# EAGLE schematic projectVGA (EAGLE 4.16)
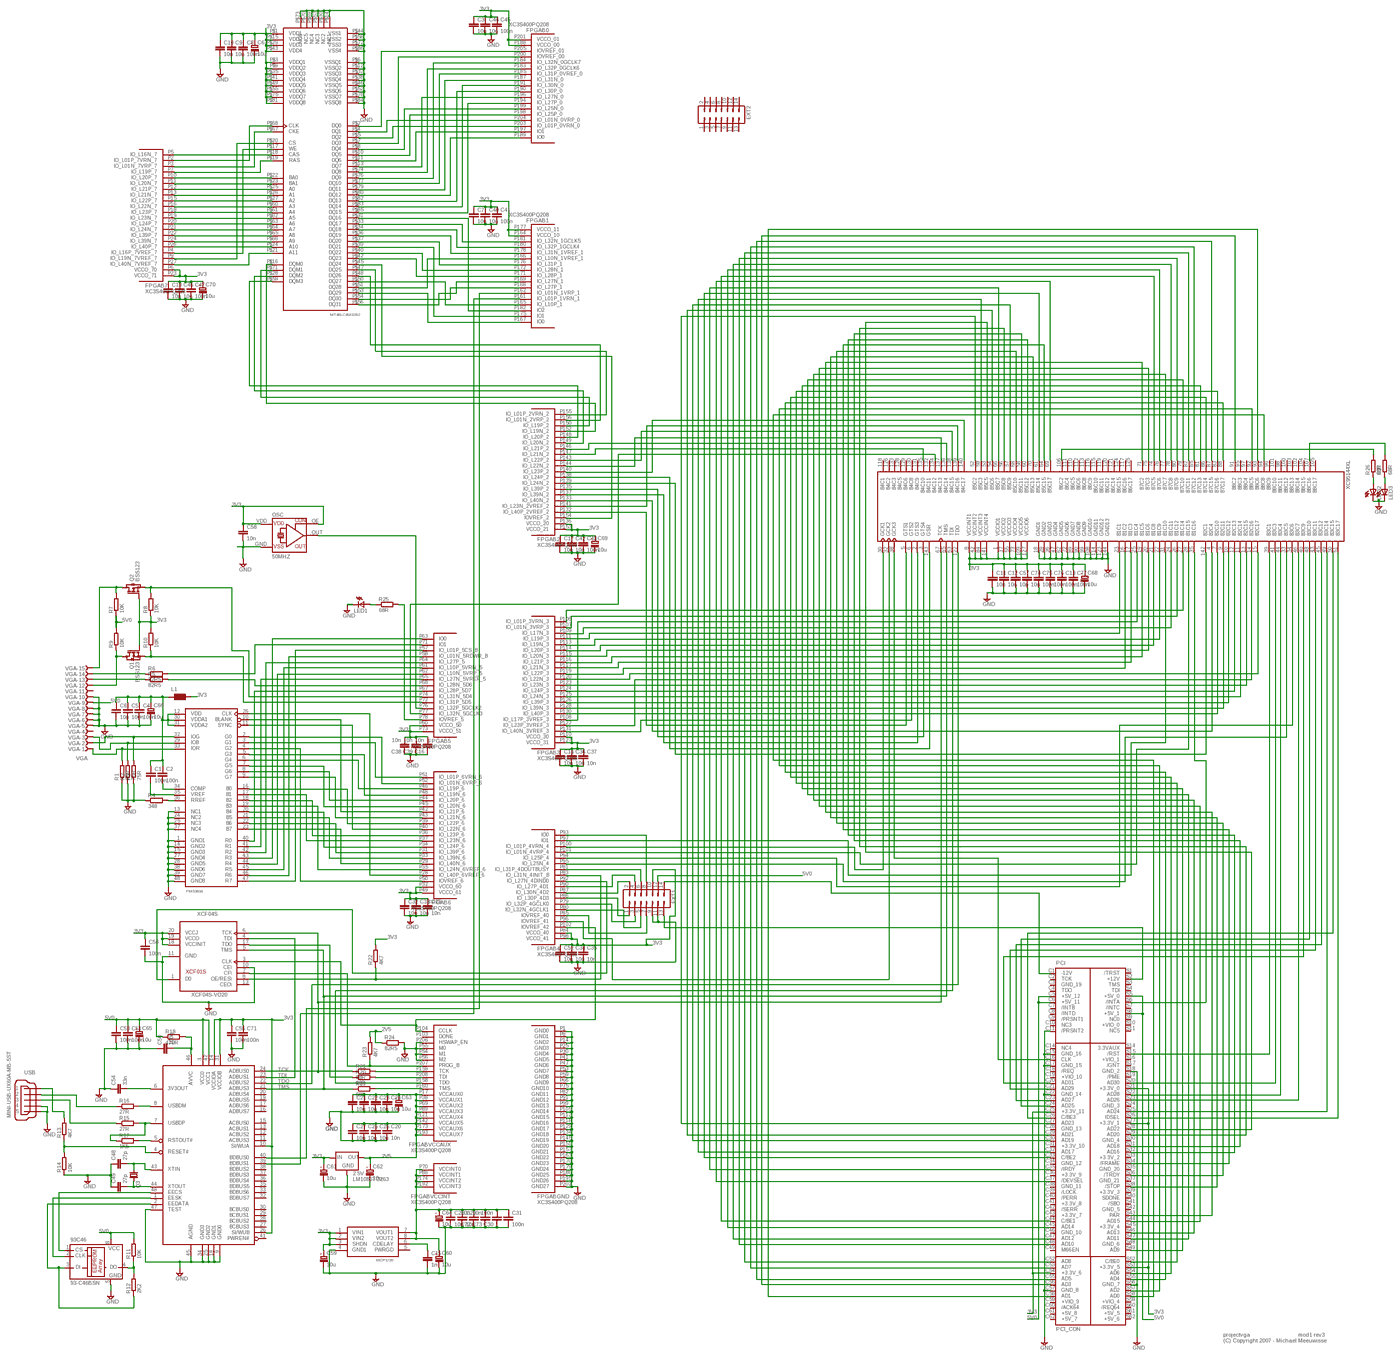
[diagram p0: schematic, sheet 1, overview]
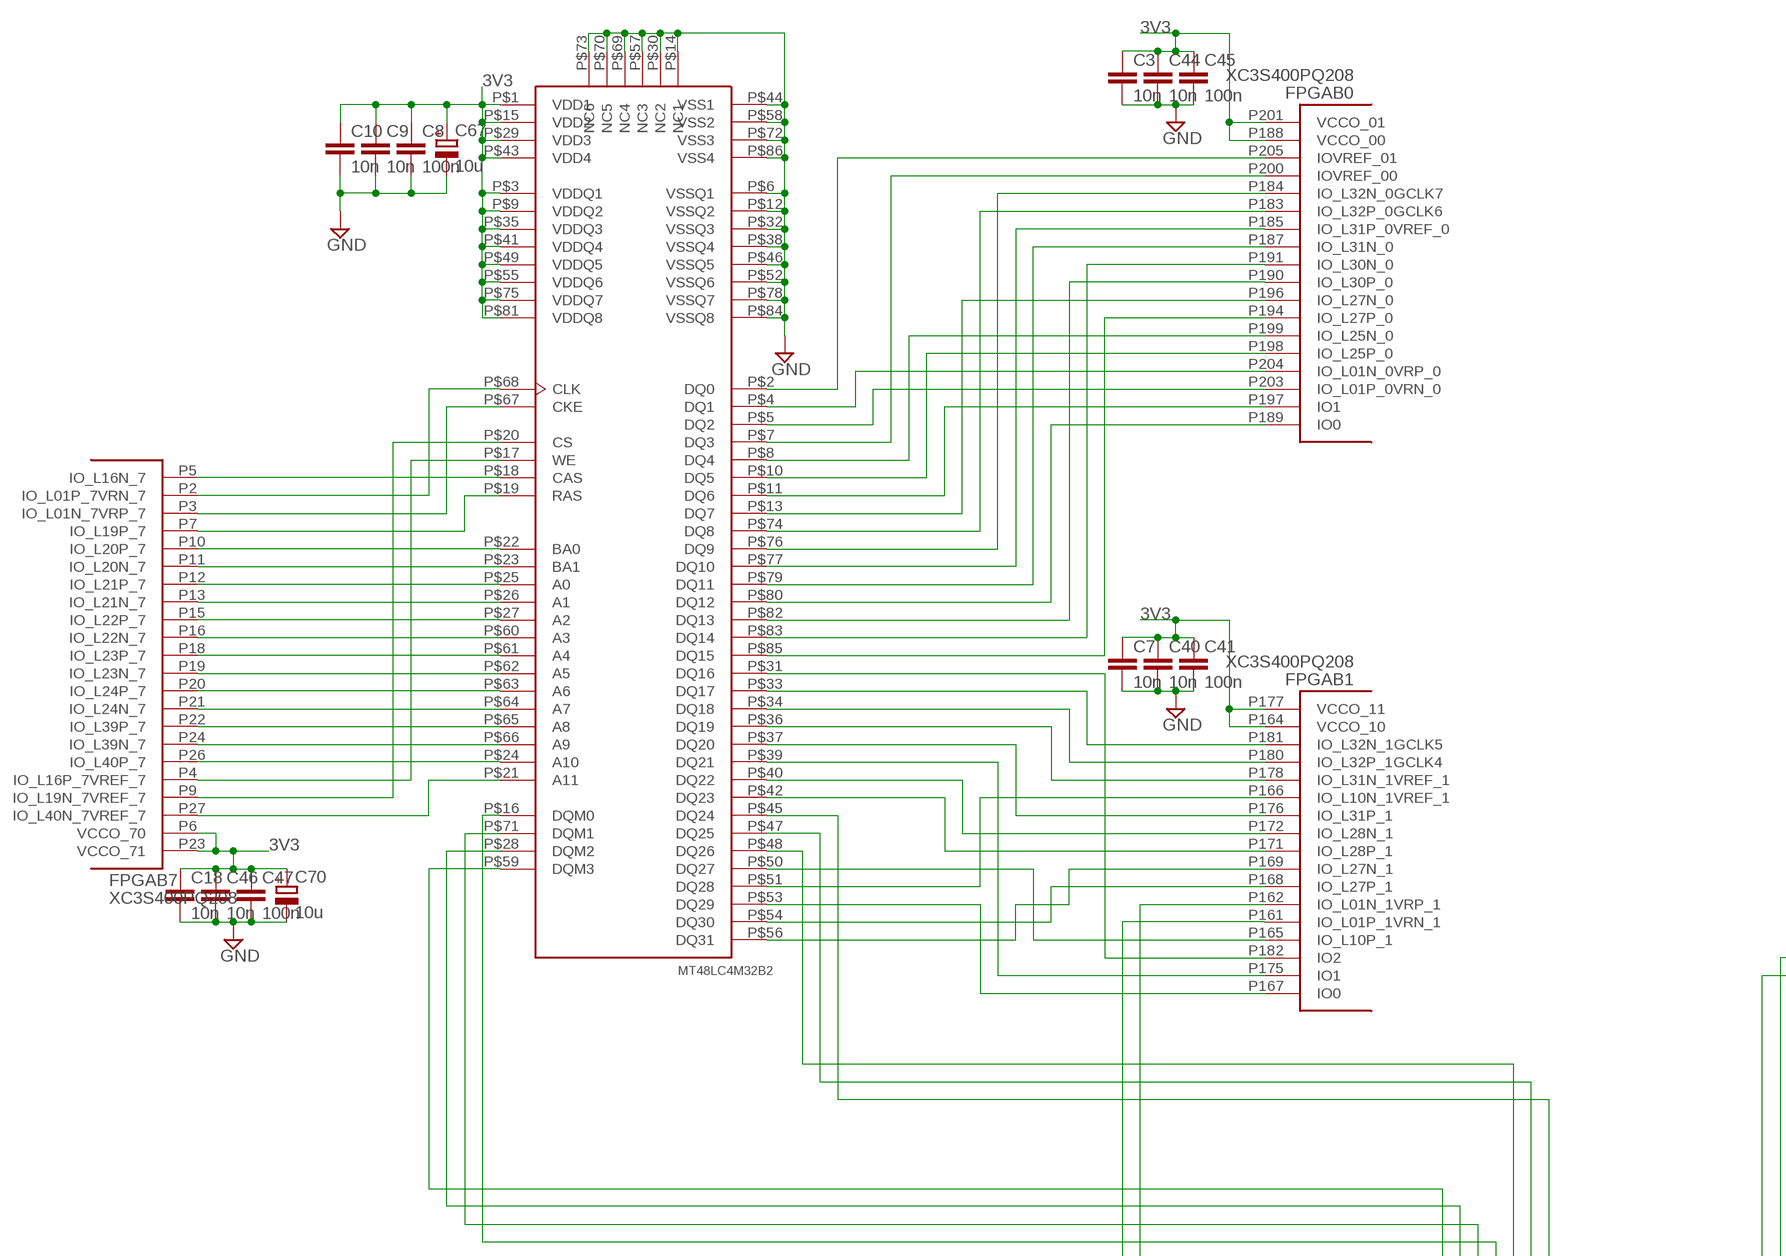
[diagram p1: schematic, sheet 1, part 1 of 4]
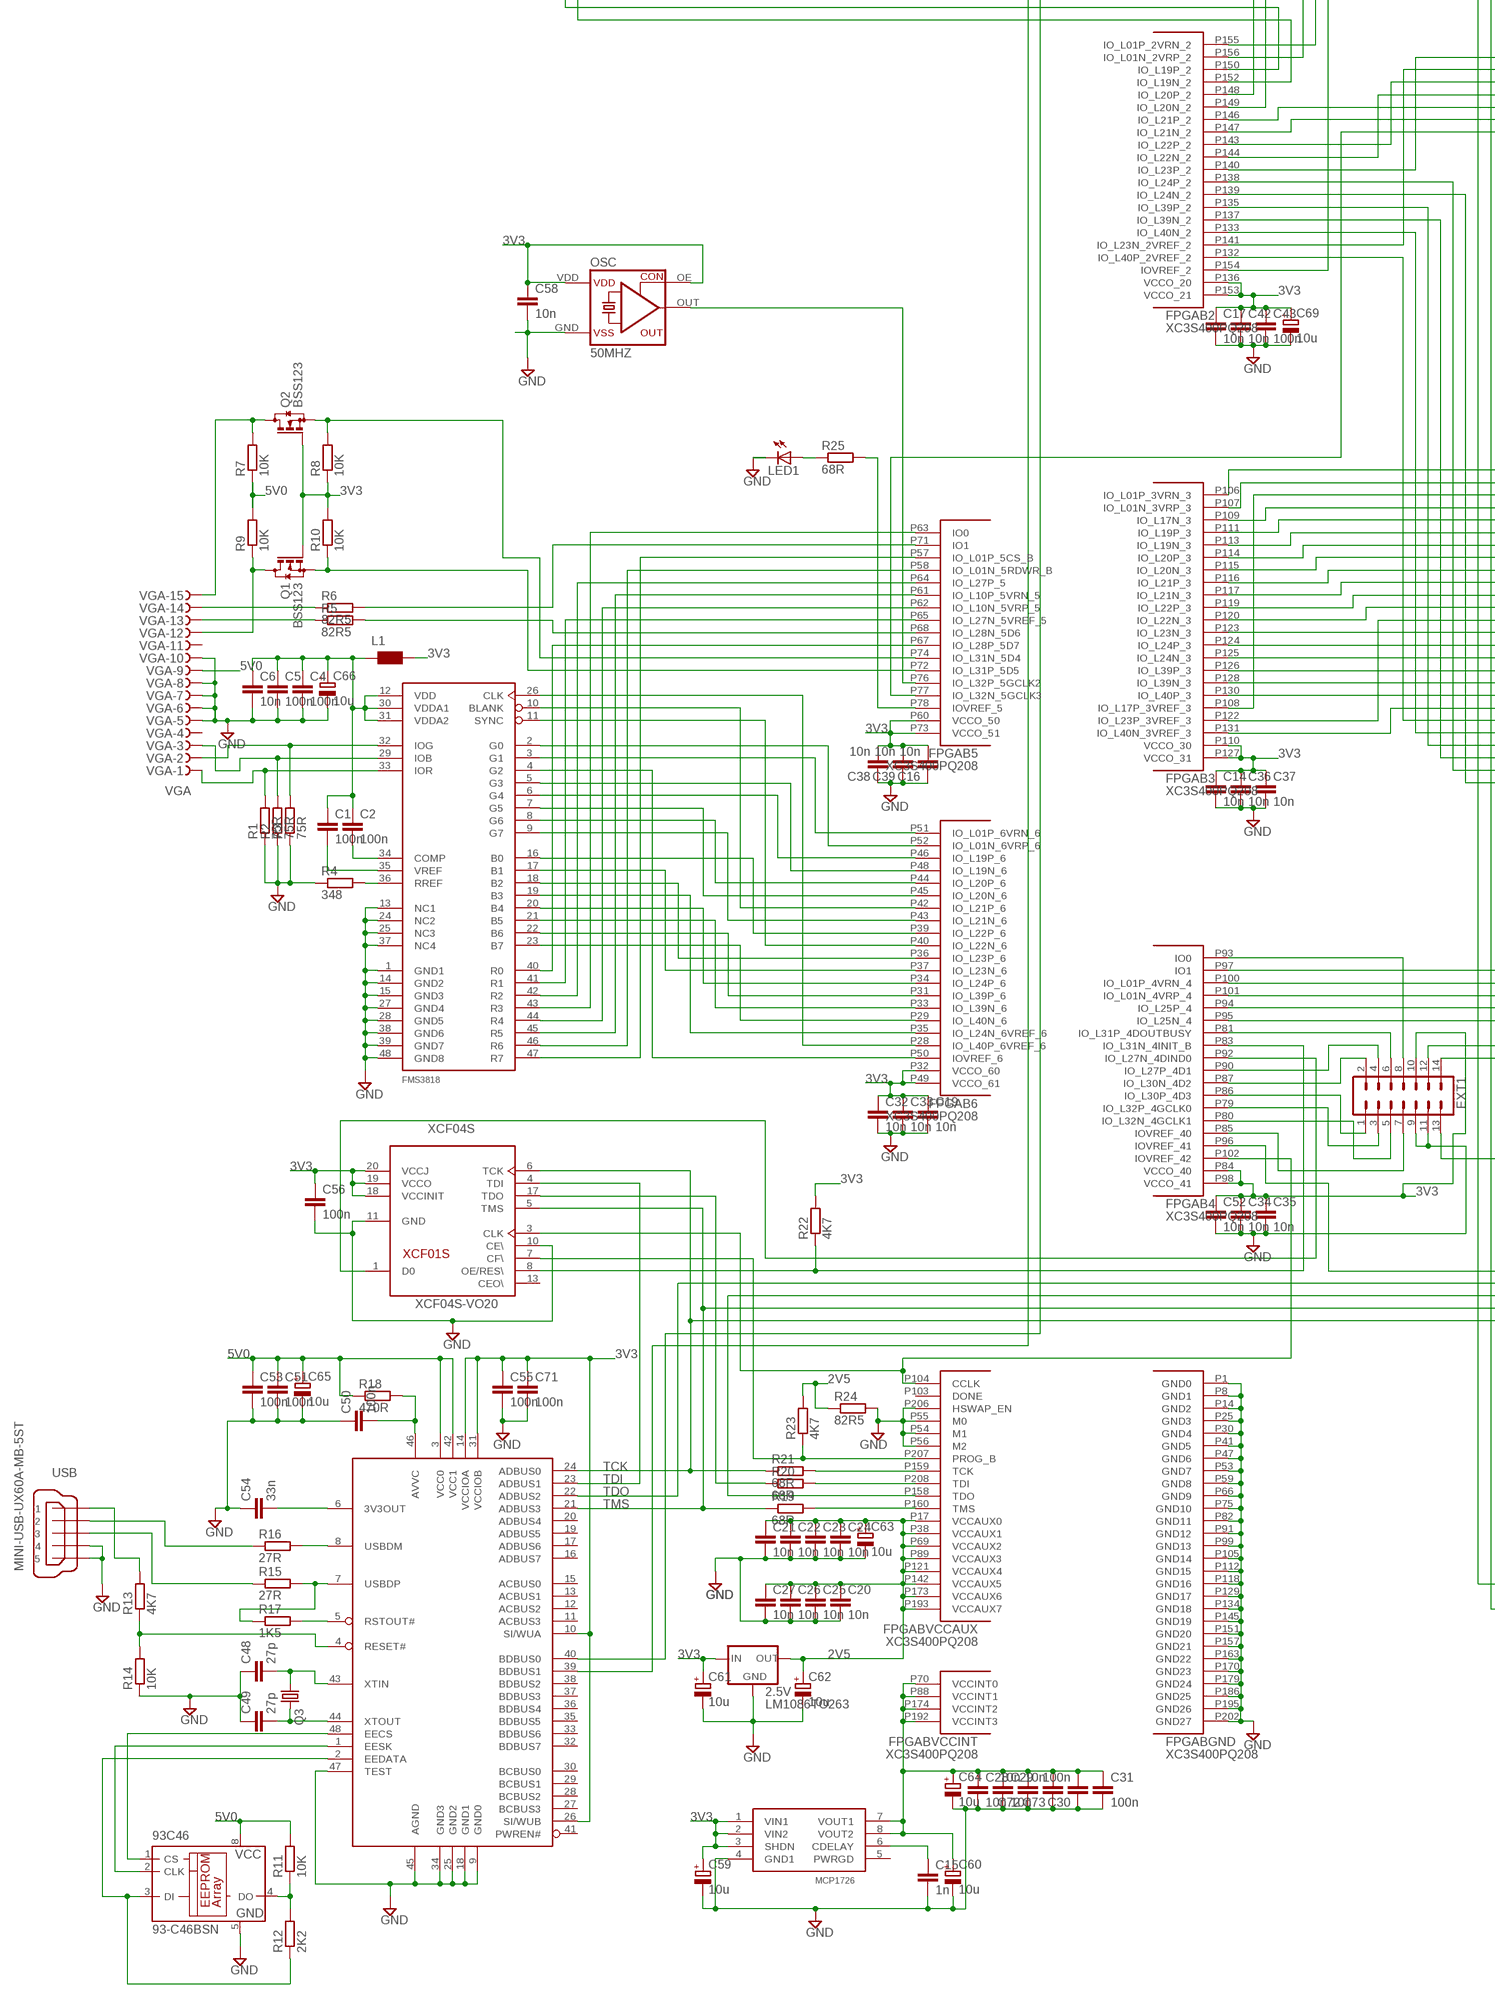
[diagram p2: schematic, sheet 1, part 2 of 4]
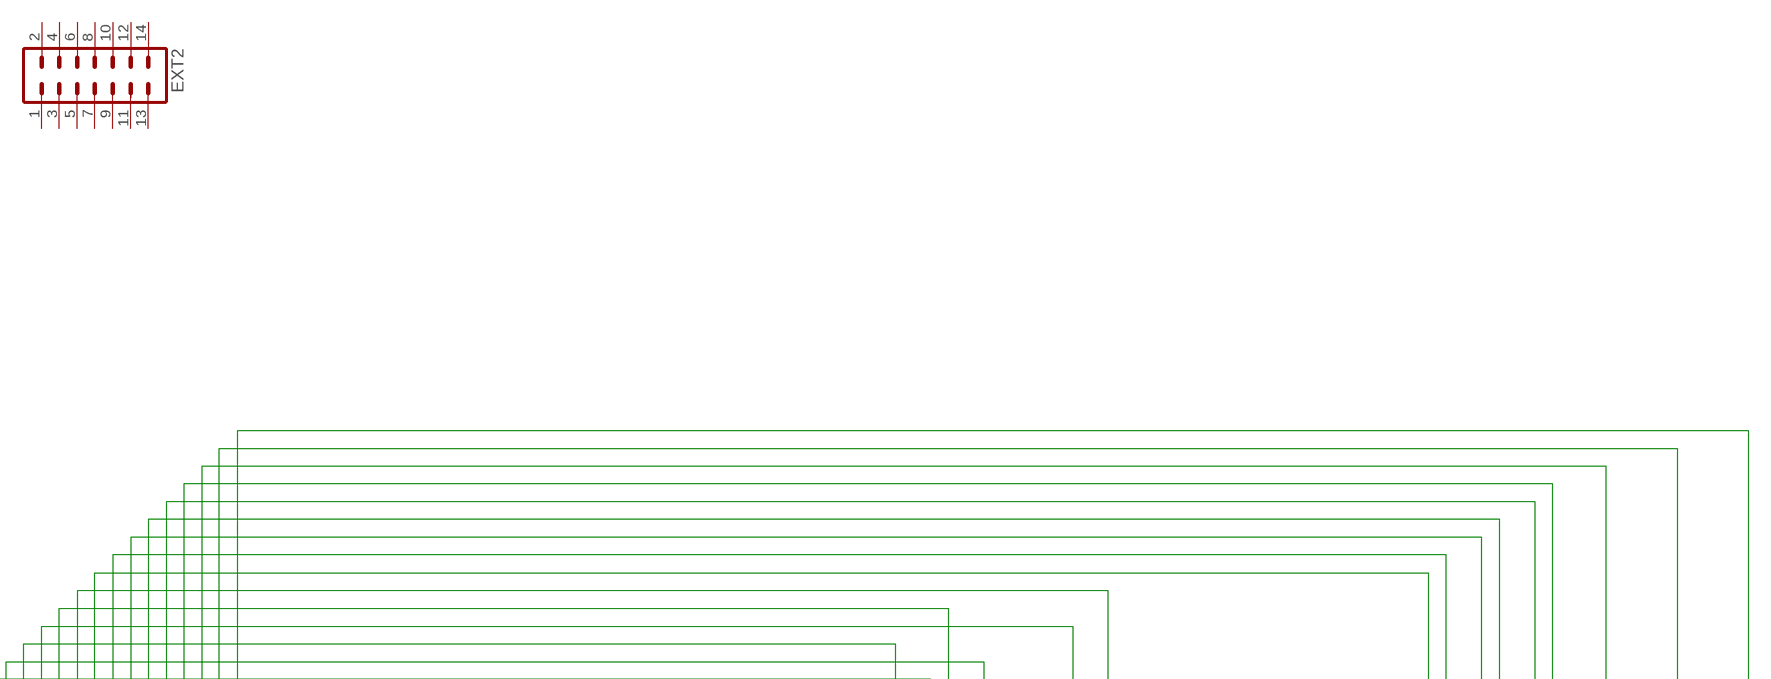
[diagram p3: schematic, sheet 1, part 3 of 4]
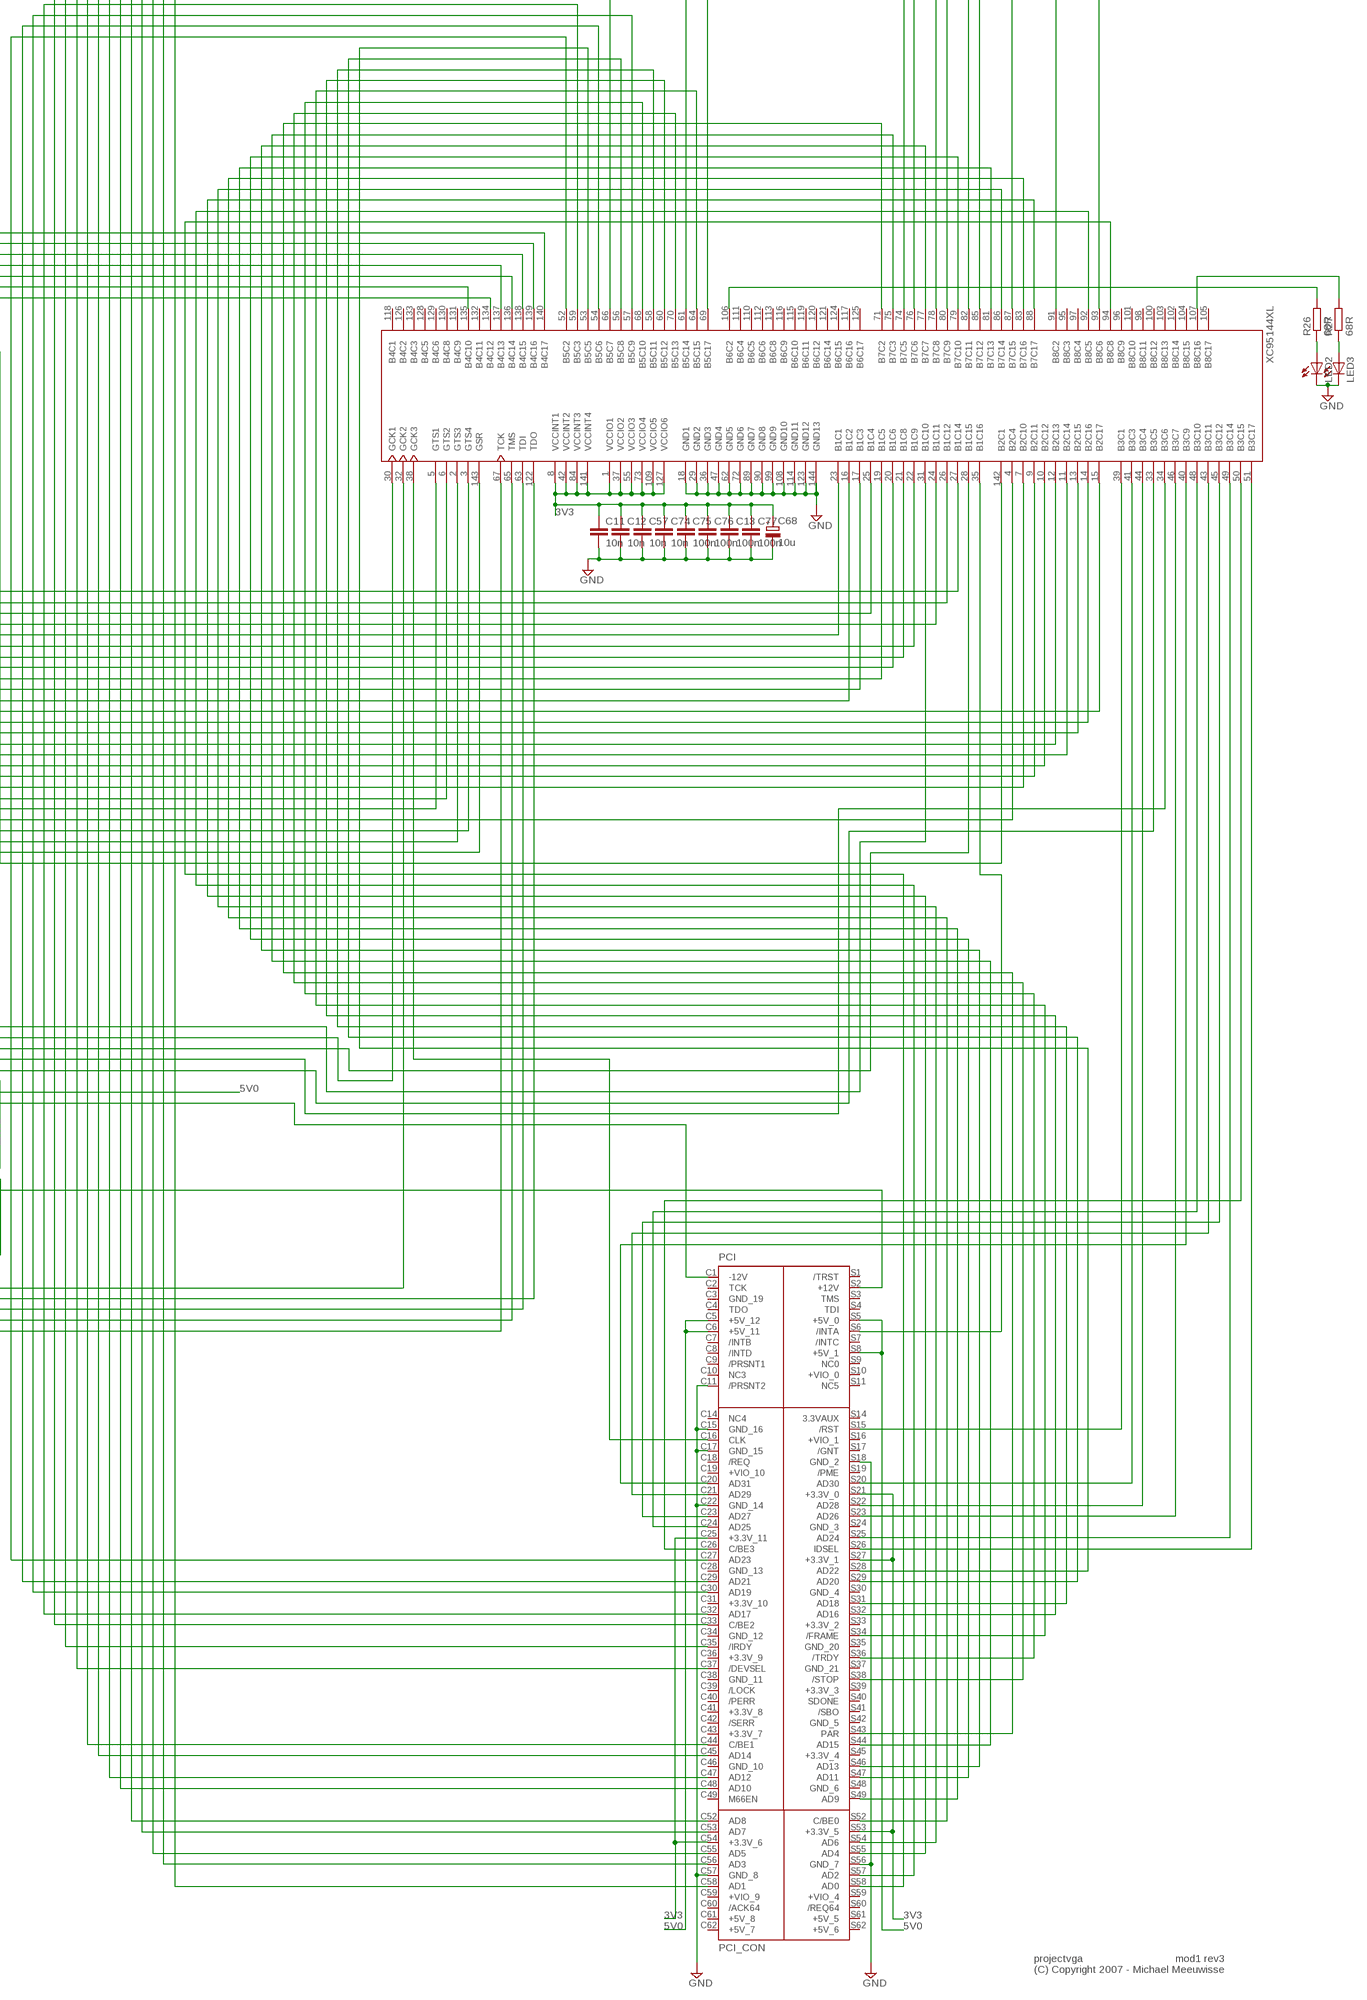
[diagram p4: schematic, sheet 1, part 4 of 4]

## Parts
1.2V  MCP1726  [SOIC8]
2.5V  LM1086TO263  [TO263]
93C46  93-C46BSN  [SO-08]
C1  100n  C-EUC0603  [C0603]
C2  100n  C-EUC0603  [C0603]
C3  10n  C-EUC0603  [C0603]
C4  100n  C-EUC0603  [C0603]
C5  100n  C-EUC0603  [C0603]
C6  10n  C-EUC0603  [C0603]
C7  10n  C-EUC0603  [C0603]
C8  100n  C-EUC0603  [C0603]
C9  10n  C-EUC0603  [C0603]
C10  10n  C-EUC0603  [C0603]
C11  10n  C-EUC0603  [C0603]
C12  10n  C-EUC0603  [C0603]
C13  100n  C-EUC0603  [C0603]
C14  10n  C-EUC0603  [C0603]
C15  1n  C-EUC0603  [C0603]
C16  10n  C-EUC0603  [C0603]
C17  10n  C-EUC0603  [C0603]
C18  10n  C-EUC0603  [C0603]
C19  10n  C-EUC0603  [C0603]
C20  10n  C-EUC0603  [C0603]
C21  10n  C-EUC0603  [C0603]
C22  10n  C-EUC0603  [C0603]
C23  10n  C-EUC0603  [C0603]
C24  10n  C-EUC0603  [C0603]
C25  10n  C-EUC0603  [C0603]
C26  10n  C-EUC0603  [C0603]
C27  10n  C-EUC0603  [C0603]
C28  10n  C-EUC0603  [C0603]
C29  10n  C-EUC0603  [C0603]
C30  100n  C-EUC0603  [C0603]
C31  100n  C-EUC0603  [C0603]
C32  10n  C-EUC0603  [C0603]
C33  10n  C-EUC0603  [C0603]
C34  10n  C-EUC0603  [C0603]
C35  10n  C-EUC0603  [C0603]
C36  10n  C-EUC0603  [C0603]
C37  10n  C-EUC0603  [C0603]
C38  10n  C-EUC0603  [C0603]
C39  10n  C-EUC0603  [C0603]
C40  10n  C-EUC0603  [C0603]
C41  100n  C-EUC0603  [C0603]
C42  10n  C-EUC0603  [C0603]
C43  100n  C-EUC0603  [C0603]
C44  10n  C-EUC0603  [C0603]
C45  100n  C-EUC0603  [C0603]
C46  10n  C-EUC0603  [C0603]
C47  100n  C-EUC0603  [C0603]
C48  27p  C-EUC0603  [C0603]
C49  27p  C-EUC0603  [C0603]
C50  100n  C-EUC0603  [C0603]
C51  100n  C-EUC0603  [C0603]
C52  10n  C-EUC0603  [C0603]
C53  100n  C-EUC0603  [C0603]
C54  33n  C-EUC0603  [C0603]
C55  100n  C-EUC0603  [C0603]
C56  100n  C-EUC0603  [C0603]
C57  10n  C-EUC0603  [C0603]
C58  10n  C-EUC0603  [C0603]
C59  10u  CPOL-EUA  [PANASONIC_A]
C60  10u  CPOL-EUA  [PANASONIC_A]
C61  10u  CPOL-EUA  [PANASONIC_A]
C62  10u  CPOL-EUA  [PANASONIC_A]
C63  10u  CPOL-EUA  [PANASONIC_A]
C64  10u  CPOL-EUA  [PANASONIC_A]
C65  10u  CPOL-EUA  [PANASONIC_A]
C66  10u  CPOL-EUA  [PANASONIC_A]
C67  10u  CPOL-EUA  [PANASONIC_A]
C68  10u  CPOL-EUA  [PANASONIC_A]
C69  10u  CPOL-EUA  [PANASONIC_A]
C70  10u  CPOL-EUA  [PANASONIC_A]
C71  100n  C-EUC0603  [C0603]
C72  10n  C-EUC0603  [C0603]
C73  10n  C-EUC0603  [C0603]
C74  10n  C-EUC0603  [C0603]
C75  100n  C-EUC0603  [C0603]
C76  100n  C-EUC0603  [C0603]
C77  100n  C-EUC0603  [C0603]
CPLD  XC95144XL  [TQ144]
DAC  FMS3818  [LQFP48]
EXT1  ML14  [ML14]
EXT2  ML14  [ML14]
FPGA  XC3S400PQ208  [PQ208]
FTDI  FTDI2232L  FT2232L  [LQFP48]
L1  WE-CBF_0805  [0805]
LED1  LEDCHIP-LED0805  [CHIP-LED0805]
LED2  LEDCHIP-LED0805  [CHIP-LED0805]
LED3  LEDCHIP-LED0805  [CHIP-LED0805]
OSC  50MHZ  CRYSTAL_RES--  [ASE]
PCI  PCI_CON  [PCI_BRDL]
Q1  BSS123  [SOT23]
Q2  BSS123  [SOT23]
Q3  CRYSTALHC49UP  [HC49UP]
R1  75R  R-EU_R0603  [R0603]
R2  75R  R-EU_R0603  [R0603]
R3  75R  R-EU_R0603  [R0603]
R4  348  R-EU_R0603  [R0603]
R5  82R5  R-EU_R0603  [R0603]
R6  82R5  R-EU_R0603  [R0603]
R7  10K  R-EU_R0603  [R0603]
R8  10K  R-EU_R0603  [R0603]
R9  10K  R-EU_R0603  [R0603]
R10  10K  R-EU_R0603  [R0603]
R11  10K  R-EU_R0603  [R0603]
R12  2K2  R-EU_R0603  [R0603]
R13  4K7  R-EU_R0603  [R0603]
R14  10K  R-EU_R0603  [R0603]
R15  27R  R-EU_R0603  [R0603]
R16  27R  R-EU_R0603  [R0603]
R17  1K5  R-EU_R0603  [R0603]
R18  470R  R-EU_R0603  [R0603]
R19  68R  R-EU_R0603  [R0603]
R20  68R  R-EU_R0603  [R0603]
R21  68R  R-EU_R0603  [R0603]
R22  4K7  R-EU_R0603  [R0603]
R23  4K7  R-EU_R0603  [R0603]
R24  82R5  R-EU_R0603  [R0603]
R25  68R  R-EU_R0603  [R0603]
R26  68R  R-EU_R0603  [R0603]
R27  68R  R-EU_R0603  [R0603]
SDRAM  MT48LC4M32B2  [86TSOP]
USB  MINI-USB-UX60A-MB-5ST  [UX60A-MB-5ST]
VGA  HF15HS  [HDF15H]
XCF04S  XCF04S-VO20  XCF01S-VO20  [VO20]

## Nets
1V2: 1.2V.7(VOUT1) 1.2V.8(VOUT2) C28.1 C29.1 C30.2 C31.1 C60.+ C64.+ C72.2 C73.2 FPGA.P70(BVCCINT:VCCINT0) FPGA.P88(BVCCINT:VCCINT1) FPGA.P174(BVCCINT:VCCINT2) FPGA.P192(BVCCINT:VCCINT3)
2V5: 2.5V.2(OUT) C20.1 C21.1 C22.1 C23.1 C24.1 C25.1 C26.1 C27.1 C62.+ C63.+ FPGA.P17(BVCCAUX:VCCAUX0) FPGA.P38(BVCCAUX:VCCAUX1) FPGA.P69(BVCCAUX:VCCAUX2) FPGA.P89(BVCCAUX:VCCAUX3) FPGA.P121(BVCCAUX:VCCAUX4) FPGA.P142(BVCCAUX:VCCAUX5) FPGA.P173(BVCCAUX:VCCAUX6) FPGA.P193(BVCCAUX:VCCAUX7) R23.2 R24.1
3V3: 1.2V.1(VIN1) 1.2V.2(VIN2) 1.2V.3(SHDN) 2.5V.3(IN) C3.1 C7.1 C8.1 C9.1 C10.1 C11.1 C12.1 C13.1 C14.1 C16.2 C17.1 C18.1 C19.1 C32.1 C33.1 C34.1 C35.1 C36.1 C37.1 C38.2 C39.2 C40.1 C41.1 C42.1 C43.1 C44.1 C45.1 C46.1 C47.1 C52.1 C55.1 C56.1 C57.1 C58.1 C59.+ C61.+ C67.+ C68.+ C69.+ C70.+ C71.1 C74.1 C75.1 C76.1 C77.1 CPLD.1(VCCIO1) CPLD.8(VCCINT1) CPLD.37(VCCIO2) CPLD.42(VCCINT2) CPLD.55(VCCIO3) CPLD.73(VCCIO4) CPLD.84(VCCINT3) CPLD.109(VCCIO5) CPLD.127(VCCIO6) CPLD.141(VCCINT4) EXT1.10 FPGA.P6(B7:VCCO_70) FPGA.P23(B7:VCCO_71) FPGA.P32(B6:VCCO_60) FPGA.P49(B6:VCCO_61) FPGA.P60(B5:VCCO_50) FPGA.P73(B5:VCCO_51) FPGA.P84(B4:VCCO_40) FPGA.P98(B4:VCCO_41) FPGA.P110(B3:VCCO_30) FPGA.P127(B3:VCCO_31) FPGA.P136(B2:VCCO_20) FPGA.P153(B2:VCCO_21) FPGA.P164(B1:VCCO_10) FPGA.P177(B1:VCCO_11) FPGA.P188(B0:VCCO_00) FPGA.P201(B0:VCCO_01) FTDI.10(SI/WUA) FTDI.14(VCCIOA) FTDI.26(SI/WUB) FTDI.31(VCCIOB) L1.2 OSC.OE(CON) OSC.VDD PCI.C25(+3.3V_11) PCI.C54(+3.3V_6) PCI.S21(+3.3V_0) PCI.S27(+3.3V_1) PCI.S53(+3.3V_5) Q1.1(G) Q2.1(G) R8.1 R10.2 R22.2 SDRAM.P$1(VDD1) SDRAM.P$3(VDDQ1) SDRAM.P$9(VDDQ2) SDRAM.P$15(VDD2) SDRAM.P$29(VDD3) SDRAM.P$35(VDDQ3) SDRAM.P$41(VDDQ4) SDRAM.P$43(VDD4) SDRAM.P$49(VDDQ5) SDRAM.P$55(VDDQ6) SDRAM.P$75(VDDQ7) SDRAM.P$81(VDDQ8) XCF04S.18(VCCINIT) XCF04S.19(VCCO) XCF04S.20(VCCJ)
3V3A: C1.1 C2.1 C4.1 C5.1 C6.1 C66.+ DAC.12(VDD) DAC.30(VDDA1) DAC.31(VDDA2) L1.1
5V0: 93C46.8(VCC) C51.1 C53.1 C65.+ EXT1.12 FTDI.3(VCC0) FTDI.42(VCC1) PCI.C5(+5V_12) PCI.C6(+5V_11) PCI.S5(+5V_0) PCI.S8(+5V_1) R7.1 R9.2 R11.2 R18.1 VGA.9
+12V: EXT1.13 PCI.S2(+12V)
-12V: EXT1.14 PCI.C1(-12V)
GND: 1.2V.4(GND1) 2.5V.1(GND) 93C46.5(GND) C3.2 C4.2 C5.2 C6.2 C7.2 C8.2 C9.2 C10.2 C11.2 C12.2 C13.2 C14.2 C15.2 C16.1 C17.2 C18.2 C19.2 C20.2 C21.2 C22.2 C23.2 C24.2 C25.2 C26.2 C27.2 C28.2 C29.2 C30.1 C31.2 C32.2 C33.2 C34.2 C35.2 C36.2 C37.2 C38.1 C39.1 C40.2 C41.2 C42.2 C43.2 C44.2 C45.2 C46.2 C47.2 C48.1 C49.1 C50.1 C51.2 C52.2 C53.2 C54.1 C55.2 C56.2 C57.2 C58.2 C59.- C60.- C61.- C62.- C63.- C64.- C65.- C66.- C67.- C68.- C69.- C70.- C71.2 C72.1 C73.1 C74.2 C75.2 C76.2 C77.2 CPLD.18(GND1) CPLD.29(GND2) CPLD.36(GND3) CPLD.47(GND4) CPLD.62(GND5) CPLD.72(GND6) CPLD.89(GND7) CPLD.90(GND8) CPLD.99(GND9) CPLD.108(GND10) CPLD.114(GND11) CPLD.123(GND12) CPLD.144(GND13) DAC.1(GND1) DAC.13(NC1) DAC.14(GND2) DAC.15(GND3) DAC.24(NC2) DAC.25(NC3) DAC.27(GND4) DAC.28(GND5) DAC.37(NC4) DAC.38(GND6) DAC.39(GND7) DAC.48(GND8) EXT1.9 EXT1.11 FPGA.P1(BGND:GND0) FPGA.P8(BGND:GND1) FPGA.P14(BGND:GND2) FPGA.P25(BGND:GND3) FPGA.P30(BGND:GND4) FPGA.P41(BGND:GND5) FPGA.P47(BGND:GND6) FPGA.P53(BGND:GND7) FPGA.P54(BVCCAUX:M1) FPGA.P55(BVCCAUX:M0) FPGA.P56(BVCCAUX:M2) FPGA.P59(BGND:GND8) FPGA.P66(BGND:GND9) FPGA.P75(BGND:GND10) FPGA.P82(BGND:GND11) FPGA.P91(BGND:GND12) FPGA.P99(BGND:GND13) FPGA.P105(BGND:GND14) FPGA.P112(BGND:GND15) FPGA.P118(BGND:GND16) FPGA.P129(BGND:GND17) FPGA.P134(BGND:GND18) FPGA.P145(BGND:GND19) FPGA.P151(BGND:GND20) FPGA.P157(BGND:GND21) FPGA.P163(BGND:GND22) FPGA.P170(BGND:GND23) FPGA.P179(BGND:GND24) FPGA.P186(BGND:GND25) FPGA.P195(BGND:GND26) FPGA.P202(BGND:GND27) FPGA.P206(BVCCAUX:HSWAP_EN) FTDI.9(GND0) FTDI.18(GND1) FTDI.25(GND2) FTDI.34(GND3) FTDI.45(AGND) FTDI.47(TEST) LED1.C LED2.C LED3.C OSC.GND(VSS) PCI.C11(/PRSNT2) PCI.C15(GND_16) PCI.C17(GND_15) PCI.C22(GND_14) PCI.C57(GND_8) PCI.S18(GND_2) PCI.S56(GND_7) R1.1 R2.1 R3.1 R4.1 R14.1 R24.2 SDRAM.P$6(VSSQ1) SDRAM.P$12(VSSQ2) SDRAM.P$14(NC1) SDRAM.P$30(NC2) SDRAM.P$32(VSSQ3) SDRAM.P$38(VSSQ4) SDRAM.P$44(VSS1) SDRAM.P$46(VSSQ5) SDRAM.P$52(VSSQ6) SDRAM.P$57(NC3) SDRAM.P$58(VSS2) SDRAM.P$69(NC4) SDRAM.P$70(NC5) SDRAM.P$72(VSS3) SDRAM.P$73(NC6) SDRAM.P$78(VSSQ7) SDRAM.P$84(VSSQ8) SDRAM.P$86(VSS4) USB.4 USB.5 VGA.5 VGA.6 VGA.7 VGA.8 VGA.10 XCF04S.10(CE\) XCF04S.11(GND)
N$1: CPLD.107(B8C16) R27.2
N$2: CPLD.39(B3C1) PCI.S15(/RST)
N$3: CPLD.40(B3C9) PCI.C20(AD31)
N$4: CPLD.41(B3C3) PCI.S20(AD30)
N$5: CPLD.43(B3C11) PCI.C21(AD29)
N$6: CPLD.44(B3C4) PCI.S22(AD28)
N$7: CPLD.45(B3C12) PCI.C23(AD27)
N$8: CPLD.46(B3C7) PCI.S23(AD26)
N$9: CPLD.48(B3C10) PCI.C24(AD25)
N$10: CPLD.49(B3C14) PCI.S25(AD24)
N$11: CPLD.50(B3C15) PCI.C26(C/BE3)
N$12: CPLD.51(B3C17) PCI.S26(IDSEL)
N$13: CPLD.54(B5C6) PCI.C29(AD21)
N$14: CPLD.52(B5C2) PCI.C27(AD23)
N$15: CPLD.53(B5C5) PCI.S28(AD22)
N$16: CPLD.56(B5C8) PCI.S29(AD20)
N$17: CPLD.57(B5C9) PCI.C30(AD19)
N$18: CPLD.58(B5C11) PCI.S31(AD18)
N$19: CPLD.59(B5C3) PCI.C32(AD17)
N$20: CPLD.60(B5C12) PCI.S32(AD16)
N$21: CPLD.61(B5C14) PCI.C33(C/BE2)
N$22: CPLD.64(B5C15) PCI.S34(/FRAME)
N$23: CPLD.66(B5C7) PCI.C35(/IRDY)
N$24: CPLD.68(B5C10) PCI.S36(/TRDY)
N$25: CPLD.69(B5C17) PCI.C37(/DEVSEL)
N$26: CPLD.70(B5C13) PCI.S38(/STOP)
N$27: CPLD.35(B1C16) PCI.S6(/INTA)
N$28: CPLD.71(B7C2) PCI.S43(PAR)
N$29: CPLD.74(B7C5) PCI.C44(C/BE1)
N$30: CPLD.75(B7C3) PCI.S44(AD15)
N$31: CPLD.76(B7C6) PCI.C45(AD14)
N$32: CPLD.77(B7C7) PCI.S46(AD13)
N$33: CPLD.78(B7C8) PCI.C47(AD12)
N$34: CPLD.79(B7C10) PCI.S47(AD11)
N$35: CPLD.80(B7C9) PCI.C48(AD10)
N$36: CPLD.81(B7C13) PCI.S49(AD9)
N$37: CPLD.82(B7C11) PCI.C52(AD8)
N$38: CPLD.83(B7C16) PCI.S52(C/BE0)
N$39: CPLD.85(B7C12) PCI.C53(AD7)
N$40: CPLD.86(B7C14) PCI.S54(AD6)
N$41: CPLD.88(B7C17) PCI.S55(AD4)
N$42: CPLD.92(B8C5) PCI.S57(AD2)
N$43: CPLD.94(B8C8) PCI.S58(AD0)
N$44: CPLD.87(B7C15) PCI.C55(AD5)
N$45: CPLD.91(B8C2) PCI.C56(AD3)
N$46: CPLD.135(B4C10) FPGA.P147(B2:IO_L21N_2)
N$47: CPLD.93(B8C6) PCI.C58(AD1)
N$48: CPLD.136(B4C14) FPGA.P146(B2:IO_L21P_2)
N$49: CPLD.137(B4C13) FPGA.P144(B2:IO_L22N_2)
N$50: CPLD.138(B4C15) FPGA.P143(B2:IO_L22P_2)
N$51: CPLD.139(B4C16) FPGA.P141(B2:IO_L23N_2VREF_2)
N$52: CPLD.140(B4C17) FPGA.P140(B2:IO_L23P_2)
N$53: CPLD.142(B2C1) FPGA.P139(B2:IO_L24N_2)
N$54: CPLD.143(GSR) FPGA.P138(B2:IO_L24P_2)
N$55: CPLD.2(GTS3) FPGA.P137(B2:IO_L39N_2)
N$56: CPLD.3(GTS4) FPGA.P135(B2:IO_L39P_2)
N$57: CPLD.4(B2C4) FPGA.P133(B2:IO_L40N_2)
N$58: CPLD.5(GTS1) FPGA.P132(B2:IO_L40P_2VREF_2)
N$59: CPLD.6(GTS2) FPGA.P131(B3:IO_L40N_3VREF_3)
N$60: CPLD.7(B2C10) FPGA.P130(B3:IO_L40P_3)
N$61: CPLD.9(B2C11) FPGA.P128(B3:IO_L39N_3)
N$62: CPLD.10(B2C12) FPGA.P126(B3:IO_L39P_3)
N$63: CPLD.11(B2C14) FPGA.P125(B3:IO_L24N_3)
N$64: CPLD.12(B2C13) FPGA.P124(B3:IO_L24P_3)
N$65: CPLD.13(B2C15) FPGA.P123(B3:IO_L23N_3)
N$66: CPLD.14(B2C16) FPGA.P122(B3:IO_L23P_3VREF_3)
N$67: CPLD.15(B2C17) FPGA.P120(B3:IO_L22N_3)
N$68: CPLD.16(B1C2) FPGA.P119(B3:IO_L22P_3)
N$69: CPLD.17(B1C3) FPGA.P117(B3:IO_L21N_3)
N$70: CPLD.19(B1C5) FPGA.P116(B3:IO_L21P_3)
N$71: CPLD.20(B1C6) FPGA.P115(B3:IO_L20N_3)
N$72: CPLD.21(B1C8) FPGA.P114(B3:IO_L20P_3)
N$73: CPLD.22(B1C9) FPGA.P113(B3:IO_L19N_3)
N$74: CPLD.23(B1C1) FPGA.P111(B3:IO_L19P_3)
N$75: CPLD.24(B1C11) FPGA.P109(B3:IO_L17N_3)
N$76: CPLD.31(B1C10) FPGA.P97(B4:IO1)
N$77: CPLD.25(B1C4) FPGA.P108(B3:IO_L17P_3VREF_3)
N$78: CPLD.26(B1C12) FPGA.P107(B3:IO_L01N_3VRP_3)
N$79: CPLD.27(B1C14) FPGA.P106(B3:IO_L01P_3VRN_3)
N$80: CPLD.28(B1C15) FPGA.P101(B4:IO_L01N_4VRP_4)
N$81: CPLD.30(GCK1) FPGA.P100(B4:IO_L01P_4VRN_4)
N$82: CPLD.32(GCK2) FPGA.P96(B4:IOVREF_41)
N$83: CPLD.33(B3C5) FPGA.P95(B4:IO_L25N_4)
N$84: CPLD.34(B3C6) FPGA.P94(B4:IO_L25P_4)
N$85: DAC.26(CLK) FPGA.P28(B6:IO_L40P_6VREF_6)
N$86: DAC.23(B7) FPGA.P29(B6:IO_L40N_6)
N$87: DAC.22(B6) FPGA.P31(B6:IO_L39P_6)
N$88: DAC.21(B5) FPGA.P33(B6:IO_L39N_6)
N$89: DAC.20(B4) FPGA.P34(B6:IO_L24P_6)
N$90: DAC.19(B3) FPGA.P35(B6:IO_L24N_6VREF_6)
N$91: DAC.18(B2) FPGA.P36(B6:IO_L23P_6)
N$92: DAC.17(B1) FPGA.P37(B6:IO_L23N_6)
N$93: DAC.16(B0) FPGA.P39(B6:IO_L22P_6)
N$94: DAC.11(SYNC) FPGA.P40(B6:IO_L22N_6)
N$95: DAC.10(BLANK) FPGA.P42(B6:IO_L21P_6)
N$96: DAC.9(G7) FPGA.P43(B6:IO_L21N_6)
N$97: DAC.8(G6) FPGA.P44(B6:IO_L20P_6)
N$98: DAC.7(G5) FPGA.P45(B6:IO_L20N_6)
N$99: DAC.6(G4) FPGA.P46(B6:IO_L19P_6)
N$100: DAC.5(G3) FPGA.P48(B6:IO_L19N_6)
N$101: DAC.4(G2) FPGA.P50(B6:IOVREF_6)
N$102: DAC.3(G1) FPGA.P51(B6:IO_L01P_6VRN_6)
N$103: DAC.2(G0) FPGA.P52(B6:IO_L01N_6VRP_6)
N$104: DAC.47(R7) FPGA.P57(B5:IO_L01P_5CS_B)
N$105: DAC.46(R6) FPGA.P58(B5:IO_L01N_5RDWR_B)
N$106: DAC.45(R5) FPGA.P61(B5:IO_L10P_5VRN_5)
N$107: DAC.44(R4) FPGA.P62(B5:IO_L10N_5VRP_5)
N$108: DAC.43(R3) FPGA.P63(B5:IO0)
N$109: DAC.42(R2) FPGA.P64(B5:IO_L27P_5)
N$110: DAC.41(R1) FPGA.P65(B5:IO_L27N_5VREF_5)
N$111: DAC.40(R0) FPGA.P67(B5:IO_L28P_5D7)
N$112: FPGA.P68(B5:IO_L28N_5D6) R5.2
N$113: FPGA.P71(B5:IO1) R6.2
N$114: FPGA.P22(B7:IO_L39P_7) SDRAM.P$65(A8)
N$115: FPGA.P21(B7:IO_L24N_7) SDRAM.P$64(A7)
N$116: FPGA.P20(B7:IO_L24P_7) SDRAM.P$63(A6)
N$117: FPGA.P19(B7:IO_L23N_7) SDRAM.P$62(A5)
N$118: FPGA.P18(B7:IO_L23P_7) SDRAM.P$61(A4)
N$119: FPGA.P16(B7:IO_L22N_7) SDRAM.P$60(A3)
N$120: FPGA.P15(B7:IO_L22P_7) SDRAM.P$27(A2)
N$121: FPGA.P13(B7:IO_L21N_7) SDRAM.P$26(A1)
N$122: FPGA.P12(B7:IO_L21P_7) SDRAM.P$25(A0)
N$123: FPGA.P11(B7:IO_L20N_7) SDRAM.P$23(BA1)
N$124: FPGA.P10(B7:IO_L20P_7) SDRAM.P$22(BA0)
N$125: FPGA.P24(B7:IO_L39N_7) SDRAM.P$66(A9)
N$126: FPGA.P26(B7:IO_L40P_7) SDRAM.P$24(A10)
N$127: FPGA.P27(B7:IO_L40N_7VREF_7) SDRAM.P$21(A11)
N$128: FPGA.P7(B7:IO_L19P_7) SDRAM.P$19(RAS)
N$129: FPGA.P5(B7:IO_L16N_7) SDRAM.P$18(CAS)
N$130: FPGA.P4(B7:IO_L16P_7VREF_7) SDRAM.P$17(WE)
N$131: FPGA.P3(B7:IO_L01N_7VRP_7) SDRAM.P$67(CKE)
N$132: FPGA.P2(B7:IO_L01P_7VRN_7) SDRAM.P$68(CLK)
N$133: FPGA.P148(B2:IO_L20P_2) SDRAM.P$59(DQM3)
N$134: FPGA.P149(B2:IO_L20N_2) SDRAM.P$28(DQM2)
N$135: FPGA.P150(B2:IO_L19P_2) SDRAM.P$71(DQM1)
N$136: FPGA.P152(B2:IO_L19N_2) SDRAM.P$16(DQM0)
N$137: FPGA.P154(B2:IOVREF_2) SDRAM.P$45(DQ24)
N$138: FPGA.P155(B2:IO_L01P_2VRN_2) SDRAM.P$47(DQ25)
N$139: FPGA.P165(B1:IO_L10P_1) SDRAM.P$50(DQ27)
N$140: FPGA.P156(B2:IO_L01N_2VRP_2) SDRAM.P$48(DQ26)
N$141: FPGA.P205(B0:IOVREF_01) SDRAM.P$2(DQ0)
N$142: FPGA.P204(B0:IO_L01N_0VRP_0) SDRAM.P$4(DQ1)
N$143: FPGA.P203(B0:IO_L01P_0VRN_0) SDRAM.P$5(DQ2)
N$144: FPGA.P200(B0:IOVREF_00) SDRAM.P$7(DQ3)
N$145: FPGA.P199(B0:IO_L25N_0) SDRAM.P$8(DQ4)
N$146: FPGA.P198(B0:IO_L25P_0) SDRAM.P$10(DQ5)
N$147: FPGA.P197(B0:IO1) SDRAM.P$11(DQ6)
N$148: FPGA.P196(B0:IO_L27N_0) SDRAM.P$13(DQ7)
N$149: FPGA.P189(B0:IO0) SDRAM.P$80(DQ12)
N$150: FPGA.P187(B0:IO_L31N_0) SDRAM.P$79(DQ11)
N$151: FPGA.P185(B0:IO_L31P_0VREF_0) SDRAM.P$77(DQ10)
N$152: FPGA.P166(B1:IO_L10N_1VREF_1) SDRAM.P$51(DQ28)
N$153: FPGA.P167(B1:IO0) SDRAM.P$53(DQ29)
N$154: FPGA.P190(B0:IO_L30P_0) SDRAM.P$82(DQ13)
N$155: FPGA.P191(B0:IO_L30N_0) SDRAM.P$83(DQ14)
N$156: FPGA.P194(B0:IO_L27P_0) SDRAM.P$85(DQ15)
N$157: FPGA.P182(B1:IO2) SDRAM.P$31(DQ16)
N$158: FPGA.P181(B1:IO_L32N_1GCLK5) SDRAM.P$33(DQ17)
N$159: FPGA.P180(B1:IO_L32P_1GCLK4) SDRAM.P$34(DQ18)
N$160: FPGA.P178(B1:IO_L31N_1VREF_1) SDRAM.P$36(DQ19)
N$161: FPGA.P176(B1:IO_L31P_1) SDRAM.P$37(DQ20)
N$162: FPGA.P175(B1:IO1) SDRAM.P$39(DQ21)
N$163: FPGA.P172(B1:IO_L28N_1) SDRAM.P$40(DQ22)
N$164: FPGA.P171(B1:IO_L28P_1) SDRAM.P$42(DQ23)
N$165: FPGA.P168(B1:IO_L27P_1) SDRAM.P$54(DQ30)
N$166: FPGA.P169(B1:IO_L27N_1) SDRAM.P$56(DQ31)
N$168: FPGA.P161(B1:IO_L01P_1VRN_1) FTDI.39(BDBUS1)
N$170: R13.2 USB.1
N$171: FPGA.P9(B7:IO_L19N_7VREF_7) SDRAM.P$20(CS)
N$172: CPLD.106(B6C2) R26.2
N$173: DAC.32(IOG) R3.2 VGA.2
N$174: DAC.29(IOB) R2.2 VGA.3
N$175: DAC.33(IOR) R1.2 VGA.1
N$176: C2.2 DAC.34(COMP)
N$177: C1.2 DAC.35(VREF)
N$178: DAC.36(RREF) R4.2
N$179: CPLD.38(GCK3) PCI.C16(CLK)
N$180: R6.1 VGA.14
N$181: R5.1 VGA.13
N$182: Q1.3(D) R9.1 VGA.12
N$183: Q2.3(D) R7.2 VGA.15
N$184: 1.2V.6(CDELAY) C15.1
N$185: C48.2 FTDI.43(XTIN) Q3.1
N$186: FPGA.P72(B5:IO_L31P_5D5) Q1.2(S) R10.1
N$187: FPGA.P74(B5:IO_L31N_5D4) Q2.2(S) R8.2
N$188: FPGA.P92(B4:IO_L27N_4DIND0) XCF04S.1(D0)
N$190: FPGA.P102(B4:IOVREF_42) FPGA.P104(BVCCAUX:CCLK) XCF04S.3(CLK)
N$191: C49.2 FTDI.44(XTOUT) Q3.2
N$192: FPGA.P76(B5:IO_L32P_5GCLK2) OSC.OUT
N$193: 93C46.1(CS) FTDI.48(EECS)
N$194: 93C46.2(CLK) FTDI.1(EESK)
N$195: 93C46.3(DI) FTDI.2(EEDATA) R12.1
N$196: 93C46.4(DO) R11.1 R12.2
N$197: CPLD.134(B4C12) FPGA.P77(B5:IO_L32N_5GCLK3)
N$198: FPGA.P78(B5:IOVREF_5) R25.2
N$199: FPGA.P208(BVCCAUX:TDI) R20.2
N$200: R20.1 XCF04S.17(TDO)
N$201: CPLD.63(TDI) FPGA.P158(BVCCAUX:TDO)
N$202: FPGA.P159(BVCCAUX:TCK) R21.2
N$203: FTDI.8(USBDM) R16.2
N$204: FTDI.4(RESET#) R13.1 R14.2
N$205: FPGA.P162(B1:IO_L01N_1VRP_1) FTDI.40(BDBUS0)
N$206: FTDI.7(USBDP) R15.2 R17.1
N$207: R15.1 USB.3
N$208: R16.1 USB.2
N$209: FTDI.5(RSTOUT#) R17.2
N$210: C50.2 FTDI.46(AVVC) R18.2
N$211: C54.2 FTDI.6(3V3OUT)
N$212: FPGA.P160(BVCCAUX:TMS) R19.2
N$213: FPGA.P207(BVCCAUX:PROG_B) R23.1 XCF04S.7(CF\)
N$214: FPGA.P83(B4:IO_L31N_4INIT_B) R22.1 XCF04S.8(OE/RES\)
N$215: EXT1.8 FPGA.P93(B4:IO0)
N$216: EXT1.6 FPGA.P81(B4:IO_L31P_4DOUTBUSY)
N$217: EXT1.4 FPGA.P90(B4:IO_L27P_4D1)
N$218: EXT1.2 FPGA.P87(B4:IO_L30N_4D2)
N$219: EXT1.1 FPGA.P86(B4:IO_L30P_4D3)
N$220: EXT1.3 FPGA.P79(B4:IO_L32P_4GCLK0)
N$221: EXT1.5 FPGA.P80(B4:IO_L32N_4GCLK1)
N$222: EXT1.7 FPGA.P85(B4:IOVREF_40)
N$224: LED2.A R26.1
N$225: LED3.A R27.1
N$226: LED1.A R25.1
N$227: FPGA.P184(B0:IO_L32N_0GCLK7) SDRAM.P$76(DQ9)
N$230: FPGA.P183(B0:IO_L32P_0GCLK6) SDRAM.P$74(DQ8)
TCK: CPLD.67(TCK) FTDI.24(ADBUS0) R21.1 XCF04S.6(TCK)
TDI: FTDI.23(ADBUS1) XCF04S.4(TDI)
TDO: CPLD.122(TDO) FTDI.22(ADBUS2)
TMS: CPLD.65(TMS) FTDI.21(ADBUS3) R19.1 XCF04S.5(TMS)
Unconnected: CPLD.95(B8C3) CPLD.96(B8C9) CPLD.97(B8C4) CPLD.98(B8C11) CPLD.100(B8C12) CPLD.101(B8C10) CPLD.102(B8C14) CPLD.103(B8C13) CPLD.104(B8C15) CPLD.105(B8C17) CPLD.110(B6C5) CPLD.111(B6C4) CPLD.112(B6C6) CPLD.113(B6C8) CPLD.115(B6C10) CPLD.116(B6C9) CPLD.117(B6C16) CPLD.118(B4C1) CPLD.119(B6C11) CPLD.120(B6C12) CPLD.121(B6C14) CPLD.124(B6C15) CPLD.125(B6C17) CPLD.126(B4C2) CPLD.128(B4C5) CPLD.129(B4C6) CPLD.130(B4C8) CPLD.131(B4C9) CPLD.132(B4C11) CPLD.133(B4C3) EXT2.1 EXT2.2 EXT2.3 EXT2.4 EXT2.5 EXT2.6 EXT2.7 EXT2.8 EXT2.9 EXT2.10 EXT2.11 EXT2.12 EXT2.13 EXT2.14 FPGA.P103(BVCCAUX:DONE) FTDI.11(ACBUS3) FTDI.12(ACBUS2) FTDI.13(ACBUS1) FTDI.15(ACBUS0) FTDI.16(ADBUS7) FTDI.17(ADBUS6) FTDI.19(ADBUS5) FTDI.20(ADBUS4) FTDI.27(BCBUS3) FTDI.28(BCBUS2) FTDI.29(BCBUS1) FTDI.30(BCBUS0) FTDI.32(BDBUS7) FTDI.33(BDBUS6) FTDI.35(BDBUS5) FTDI.36(BDBUS4) FTDI.37(BDBUS3) FTDI.38(BDBUS2) FTDI.41(PWREN#) PCI.C2(TCK) PCI.C4(TDO) PCI.C7(/INTB) PCI.C8(/INTD) PCI.C9(/PRSNT1) PCI.C10(NC3) PCI.C14(NC4) PCI.C18(/REQ) PCI.C39(/LOCK) PCI.C40(/PERR) PCI.C42(/SERR) PCI.C60(/ACK64) PCI.S1(/TRST) PCI.S3(TMS) PCI.S4(TDI) PCI.S7(/INTC) PCI.S9(NC0) PCI.S11(NC5) PCI.S14(3.3VAUX) PCI.S17(/GNT) PCI.S19(/PME) PCI.S37(GND_21) PCI.S39(+3.3V_3) PCI.S40(SDONE) PCI.S41(/SBO) PCI.S60(/REQ64) VGA.4 VGA.11 XCF04S.13(CEO\)

## Notes on the sheet
- VGA
- projectvga | mod1 rev3
- (C) Copyright 2007 - Michael Meeuwisse

## Power pins joined to a net without a drawn wire
+3.3V_2: PCI.S33(+3.3V_2)
+3.3V_4: PCI.S45(+3.3V_4)
+3.3V_7: PCI.C43(+3.3V_7)
+3.3V_8: PCI.C41(+3.3V_8)
+3.3V_9: PCI.C36(+3.3V_9)
+3.3V_10: PCI.C31(+3.3V_10)
+5V_5: PCI.S61(+5V_5)
+5V_6: PCI.S62(+5V_6)
+5V_7: PCI.C62(+5V_7)
+5V_8: PCI.C61(+5V_8)
+VIO_0: PCI.S10(+VIO_0)
+VIO_1: PCI.S16(+VIO_1)
+VIO_4: PCI.S59(+VIO_4)
+VIO_9: PCI.C59(+VIO_9)
+VIO_10: PCI.C19(+VIO_10)
GND_3: PCI.S24(GND_3)
GND_4: PCI.S30(GND_4)
GND_5: PCI.S42(GND_5)
GND_6: PCI.S48(GND_6)
GND_10: PCI.C46(GND_10)
GND_11: PCI.C38(GND_11)
GND_12: PCI.C34(GND_12)
GND_13: PCI.C28(GND_13)
GND_19: PCI.C3(GND_19)
GND_20: PCI.S35(GND_20)
M66EN: PCI.C49(M66EN)
PWRGD: 1.2V.5(PWRGD)

## Library data of the parts
1.2V = projectVGA:MCP1726
2.5V = v-reg-2:LM1086
93C46 = microchip:93-*: Serial EEPROM 512 x 8 bit/256 x 16 bit/1 K/4 K, 5.0 V, Microwire
C1-C58 C71-C77 = rcl:C-EU: CAPACITOR, European symbol
C59-C70 = rcl:CPOL-EU: POLARIZED CAPACITOR, European symbol
CPLD = projectVGA:XC95144XL
DAC = projectVGA:FMS3818
EXT1 EXT2 = con-harting-ml:ML14: HARTING
FPGA = xilinx_spartan3_virtex4_and_5:XC3S400PQ208: Xilinx FPGA
FTDI = ftdichip-3:FT2232L: USB UART / FIFO Controller 3nd Generation USB Double-UART (USB <-> Serial) - FIFO Controller
L1 = wuerth-elektronik:WE-CBF: SMD EMI Suppression Ferrite Beads - excellent anti-EMI properties - low DCR - impedances till 3000 ohms - rated current up to 6 A
LED1-LED3 = led:LED: LED OSRAM: - CHIPLED LG R971, LG N971, LY N971, LG Q971, LY Q971, LO R971, LY R971 LH N974, LH R974 LS Q976, LO Q976, LY Q976 LO Q996 - Hyper CHIPLED LW Q18S LB Q993, LB Q99A, LB R99A - SideLED LS A670, LO A670, LY A670, LG A670, LP A670 LB A673, LV A673, LT A673, LW A673 LH A674 LY A675 LS A676, LA A676, LO A676, LY A676, LW A676 LS A679, LY A679, LG A679 - Hyper Micro SIDELED® LS Y876, LA Y876, LO Y876, LY Y876 LT Y87S - SmartLED LW L88C, LW L88S LB L89C, LB L89S, LG L890 LS L89K, LO L89K, LY L89K LS L896, LA L896, LO L896, LY L896 - TOPLED LS T670, LO T670, LY T670, LG T670, LP T670 LSG T670, LSP T670, LSY T670, LOP T670, LYG T670 LG T671, LOG T671, LSG T671 LB T673, LV T673, LT T673, LW T673 LH T674 LS T676, LA T676, LO T676, LY T676, LB T676, LH T676, LSB T676, LW T676 LB T67C, LV T67C, LT T67C, LS T67K, LO T67K, LY T67K, LW E67C LS E67B, LA E67B, LO E67B, LY E67B, LB E67C, LV E67C, LT E67C LW T67C LS T679, LY T679, LG T679 LS T770, LO T770, LY T770, LG T770, LP T770 LB T773, LV T773, LT T773, LW T773 LH T774 LS E675, LA E675, LY E675, LS T675 LS T776, LA T776, LO T776, LY T776, LB T776 LHGB T686 LT T68C, LB T68C - Hyper Mini TOPLED® LB M676 - Mini TOPLED Santana® LG M470 LS M47K, LO M47K, LY M47K Source: http://www.osram.convergy.de - LUMILED® LXK2-PW12-R00, LXK2-PW12-S00, LXK2-PW14-U00, LXK2-PW14-V00 LXK2-PM12-R00, LXK2-PM12-S00, LXK2-PM14-U00 LXK2-PE12-Q00, LXK2-PE12-R00, LXK2-PE12-S00, LXK2-PE14-T00, LXK2-PE14-U00 LXK2-PB12-K00, LXK2-PB12-L00, LXK2-PB12-M00, LXK2-PB14-N00, LXK2-PB14-P00, LXK2-PB14-Q00 LXK2-PR12-L00, LXK2-PR12-M00, LXK2-PR14-Q00, LXK2-PR14-R00 LXK2-PD12-Q00, LXK2-PD12-R00, LXK2-PD12-S00 LXK2-PH12-R00, LXK2-PH12-S00 LXK2-PL12-P00, LXK2-PL12-Q00, LXK2-PL12-R00 Source: www.luxeon.com
OSC = projectVGA:CRYSTAL_RES-: CRYSTAL RESONATOR
PCI = projectVGA:PCI_CON
Q1 Q2 = transistor-small-signal:BSS123: N-CHANNEL MOS FET
Q3 = crystal:CRYSTAL: CRYSTAL
R1-R27 = rcl:R-EU_: RESISTOR, European symbol
SDRAM = projectVGA:MT48LC4M32B2
USB = con-hirose:MINI-USB-: MINI USB Connector Source: http://www.hirose.co.jp/cataloge_hp/e24000019.pdf
VGA = con-subd:HF15?S: SUB-D
XCF04S = xilinx_:XCF01S-VO20: Flash Prom with 1MBit Schinko / Baier